# EAGLE design DK_ESC (EAGLE 7.7.0)
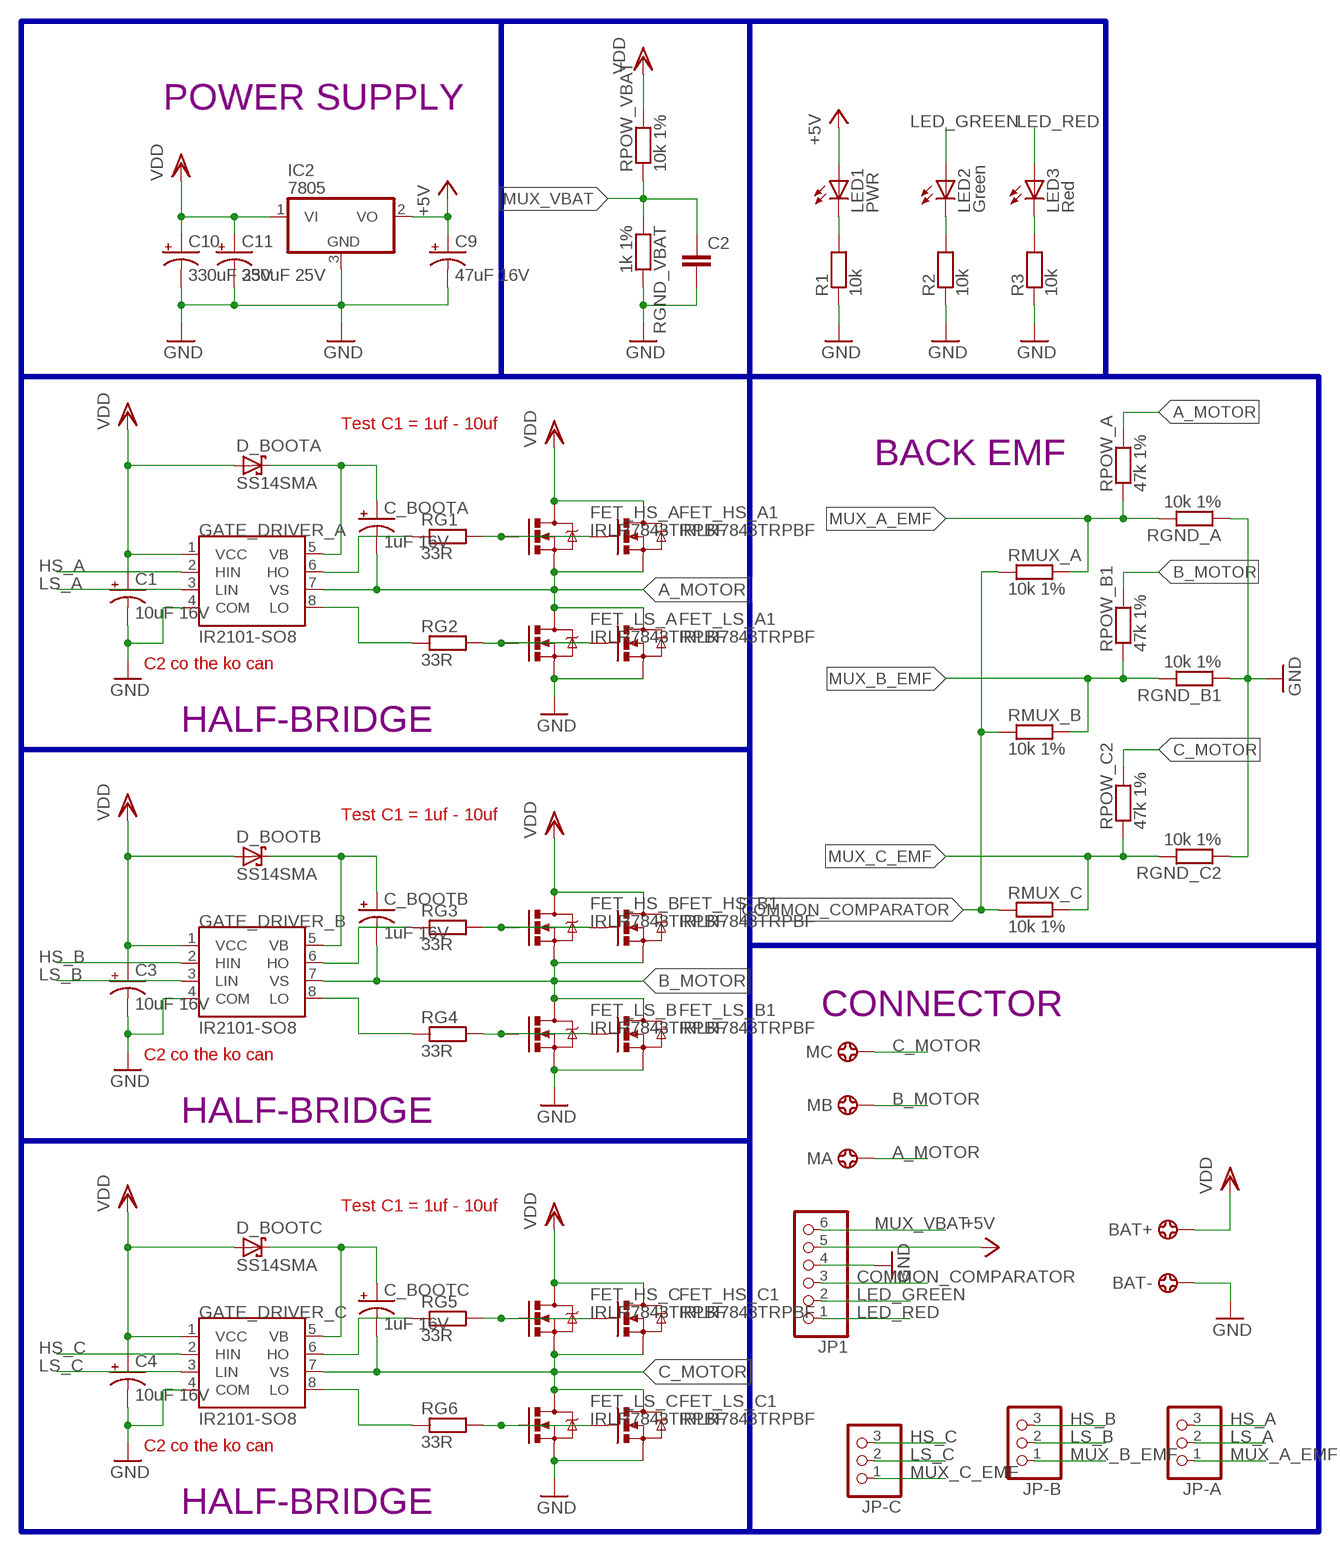
[diagram p0: schematic, sheet 1]

## Parts
BAT+  14AWG_PAD-PAD  [14AWG]
BAT-  14AWG_PAD-PAD  [14AWG]
C1  10uF 16V  CAP_POL1206-KIT  [EIA3216-KIT]
C2  C-SMDC0805K  [C0805K]
C3  10uF 16V  CAP_POL1206-KIT  [EIA3216-KIT]
C4  10uF 16V  CAP_POL1206-KIT  [EIA3216-KIT]
C9  47uF 16V  C-TANT-SMDEIA6032  [CT6032]
C10  330uF 25V  CAP_POLPTH  [CPOL-PTH-330UF-16V]
C11  330uF 25V  CAP_POLPTH  [CPOL-PTH-330UF-16V]
C_BOOTA  1uF 16V  CAP_POL1206-KIT  [EIA3216-KIT]
C_BOOTB  1uF 16V  CAP_POL1206-KIT  [EIA3216-KIT]
C_BOOTC  1uF 16V  CAP_POL1206-KIT  [EIA3216-KIT]
D_BOOTA  SS14SMA  [DO214AC]
D_BOOTB  SS14SMA  [DO214AC]
D_BOOTC  SS14SMA  [DO214AC]
FET_HS_A  IRLR7843TRPBF  IRLR7843TRPBF-DPAK  [TO252]
FET_HS_A1  IRLR7843TRPBF  IRLR7843TRPBF-DPAK  [TO252]
FET_HS_B  IRLR7843TRPBF  IRLR7843TRPBF-DPAK  [TO252]
FET_HS_B1  IRLR7843TRPBF  IRLR7843TRPBF-DPAK  [TO252]
FET_HS_C  IRLR7843TRPBF  IRLR7843TRPBF-DPAK  [TO252]
FET_HS_C1  IRLR7843TRPBF  IRLR7843TRPBF-DPAK  [TO252]
FET_LS_A  IRLR7843TRPBF  IRLR7843TRPBF-DPAK  [TO252]
FET_LS_A1  IRLR7843TRPBF  IRLR7843TRPBF-DPAK  [TO252]
FET_LS_B  IRLR7843TRPBF  IRLR7843TRPBF-DPAK  [TO252]
FET_LS_B1  IRLR7843TRPBF  IRLR7843TRPBF-DPAK  [TO252]
FET_LS_C  IRLR7843TRPBF  IRLR7843TRPBF-DPAK  [TO252]
FET_LS_C1  IRLR7843TRPBF  IRLR7843TRPBF-DPAK  [TO252]
GATE_DRIVER_A  IR2101-SO8  [SO08]
GATE_DRIVER_B  IR2101-SO8  [SO08]
GATE_DRIVER_C  IR2101-SO8  [SO08]
IC2  7805  78XXX-3P05-TO252  [TO252]
JP1  PINHD-1X6  [1X06]
JP-A  PINHD-1X3  [1X03]
JP-B  PINHD-1X3  [1X03]
JP-C  PINHD-1X3  [1X03]
LED1  PWR  LED0805  [LED_0805]
LED2  Green  LED0805  [LED_0805]
LED3  Red  LED0805  [LED_0805]
MA  14AWG_PAD-PAD  [14AWG]
MB  14AWG_PAD-PAD  [14AWG]
MC  14AWG_PAD-PAD  [14AWG]
R1  10k  RESISTOR-SMDR0805  [R0805]
R2  10k  RESISTOR-SMDR0805  [R0805]
R3  10k  RESISTOR-SMDR0805  [R0805]
RG1  33R  RESISTOR-SMDR0603  [R0603]
RG2  33R  RESISTOR-SMDR0603  [R0603]
RG3  33R  RESISTOR-SMDR0603  [R0603]
RG4  33R  RESISTOR-SMDR0603  [R0603]
RG5  33R  RESISTOR-SMDR0603  [R0603]
RG6  33R  RESISTOR-SMDR0603  [R0603]
RGND_A  10k 1%  RESISTOR-SMDR0805  [R0805]
RGND_B1  10k 1%  RESISTOR-SMDR0805  [R0805]
RGND_C2  10k 1%  RESISTOR-SMDR0805  [R0805]
RGND_VBAT  1k 1%  RESISTOR-SMDR0805  [R0805]
RMUX_A  10k 1%  RESISTOR-SMDR0805  [R0805]
RMUX_B  10k 1%  RESISTOR-SMDR0805  [R0805]
RMUX_C  10k 1%  RESISTOR-SMDR0805  [R0805]
RPOW_A  47k 1%  RESISTOR-SMDR0603  [R0603]
RPOW_B1  47k 1%  RESISTOR-SMDR0603  [R0603]
RPOW_C2  47k 1%  RESISTOR-SMDR0603  [R0603]
RPOW_VBAT  10k 1%  RESISTOR-SMDR0805  [R0805]

## Nets
+5V: C9.+ IC2.2(VO) JP1.5 LED1.A
A_MOTOR: C_BOOTA.C(-) FET_HS_A1.3(S) FET_HS_A.3(S) FET_LS_A1.2(D) FET_LS_A.2(D) GATE_DRIVER_A.7(VS) MA.1 RPOW_A.2
B_MOTOR: C_BOOTB.C(-) FET_HS_B1.3(S) FET_HS_B.3(S) FET_LS_B1.2(D) FET_LS_B.2(D) GATE_DRIVER_B.7(VS) MB.1 RPOW_B1.2
C_MOTOR: C_BOOTC.C(-) FET_HS_C1.3(S) FET_HS_C.3(S) FET_LS_C1.2(D) FET_LS_C.2(D) GATE_DRIVER_C.7(VS) MC.1 RPOW_C2.2
COMMON_COMPARATOR: JP1.3 RMUX_A.1 RMUX_B.1 RMUX_C.1
GND: BAT-.1 C1.C(-) C2.2 C3.C(-) C4.C(-) C9.- C10.- C11.- FET_LS_A1.3(S) FET_LS_A.3(S) FET_LS_B1.3(S) FET_LS_B.3(S) FET_LS_C1.3(S) FET_LS_C.3(S) GATE_DRIVER_A.4(COM) GATE_DRIVER_B.4(COM) GATE_DRIVER_C.4(COM) IC2.3(GND) JP1.4 R1.1 R2.1 R3.1 RGND_A.1 RGND_B1.1 RGND_C2.1 RGND_VBAT.2
HS_A: GATE_DRIVER_A.2(HIN) JP-A.3
HS_B: GATE_DRIVER_B.2(HIN) JP-B.3
HS_C: GATE_DRIVER_C.2(HIN) JP-C.3
LED_GREEN: JP1.2 LED2.A
LED_RED: JP1.1 LED3.A
LS_A: GATE_DRIVER_A.3(LIN) JP-A.2
LS_B: GATE_DRIVER_B.3(LIN) JP-B.2
LS_C: GATE_DRIVER_C.3(LIN) JP-C.2
MUX_A_EMF: JP-A.1 RGND_A.2 RMUX_A.2 RPOW_A.1
MUX_B_EMF: JP-B.1 RGND_B1.2 RMUX_B.2 RPOW_B1.1
MUX_C_EMF: JP-C.1 RGND_C2.2 RMUX_C.2 RPOW_C2.1
MUX_VBAT: C2.1 JP1.6 RGND_VBAT.1 RPOW_VBAT.1
N$1: FET_LS_A1.1(G) FET_LS_A.1(G) RG2.2
N$2: FET_HS_A1.1(G) FET_HS_A.1(G) RG1.2
N$3: FET_LS_B1.1(G) FET_LS_B.1(G) RG4.2
N$4: GATE_DRIVER_A.6(HO) RG1.1
N$5: GATE_DRIVER_A.8(LO) RG2.1
N$6: FET_HS_B1.1(G) FET_HS_B.1(G) RG3.2
N$7: GATE_DRIVER_B.6(HO) RG3.1
N$8: GATE_DRIVER_B.8(LO) RG4.1
N$9: FET_LS_C1.1(G) FET_LS_C.1(G) RG6.2
N$10: FET_HS_C1.1(G) FET_HS_C.1(G) RG5.2
N$11: GATE_DRIVER_C.6(HO) RG5.1
N$12: GATE_DRIVER_C.8(LO) RG6.1
N$13: LED1.C R1.2
N$16: LED2.C R2.2
N$17: LED3.C R3.2
VB: C_BOOTA.A(+) C_BOOTB.A(+) C_BOOTC.A(+) D_BOOTA.C D_BOOTB.C D_BOOTC.C GATE_DRIVER_A.5(VB) GATE_DRIVER_B.5(VB) GATE_DRIVER_C.5(VB)
VDD: BAT+.1 C1.A(+) C3.A(+) C4.A(+) C10.+ C11.+ D_BOOTA.A D_BOOTB.A D_BOOTC.A FET_HS_A1.2(D) FET_HS_A.2(D) FET_HS_B1.2(D) FET_HS_B.2(D) FET_HS_C1.2(D) FET_HS_C.2(D) GATE_DRIVER_A.1(VCC) GATE_DRIVER_B.1(VCC) GATE_DRIVER_C.1(VCC) IC2.1(VI) RPOW_VBAT.2

## Buses
B$1

## Notes on the sheet
- POWER SUPPLY
- Test C1 = 1uf - 10uf
- BACK EMF
- C2 co the ko can
- HALF-BRIDGE
- Test C1 = 1uf - 10uf
- CONNECTOR
- C2 co the ko can
- HALF-BRIDGE
- Test C1 = 1uf - 10uf
- C2 co the ko can
- HALF-BRIDGE

## Library data of the parts
BAT+ BAT- MA MB MC = Connector:14AWG_PAD: This pad use for Lipo wire
C1 C3 C4 C_BOOTA C_BOOTB C_BOOTC = Cap-Pol-Smd:CAP_POL: Capacitor Polarized These are standard SMD and PTH capacitors. Normally 10uF, 47uF, and 100uF in electrolytic and tantalum varieties. Always verify the external diameter of the through hole cap, it varies with capacity, voltage, and manufacturer. The EIA devices should be standard.
C2 = RCL:C-SMD: Capacitor Standard 0603 ceramic capacitor, and 0.1" leaded capacitor. Có đuôi "K" là loại Reflow solder
C9 = RCL:C-TANT-SMD: Tụ tantalum SMD Tụ tantalum SMD 3216 - 7343. The EIA devices should be standard.
C10 C11 = DangKiet:CAP_POL: Capacitor Polarized These are standard SMD and PTH capacitors. Normally 10uF, 47uF, and 100uF in electrolytic and tantalum varieties. Always verify the external diameter of the through hole cap, it varies with capacity, voltage, and manufacturer. The EIA devices should be standard.
D_BOOTA D_BOOTB D_BOOTC = Diode:SS14: Schottky Diode
FET_HS_A FET_HS_A1 FET_HS_B FET_HS_B1 FET_HS_C FET_HS_C1 FET_LS_A FET_LS_A1 FET_LS_B FET_LS_B1 FET_LS_C FET_LS_C1 = FET:IRLR7843TRPBF: N-Channel161A-30V, rDS(on)=0.0033 Ohm @ Vgs 10V, 140W
GATE_DRIVER_A GATE_DRIVER_B GATE_DRIVER_C = GateDriver:IR2101: High and Low Side Driver. Gate drive supply range from 10 to 20V. 3.3V, 5V logic input compatible
IC2 = Regulator-linear:78XXX-3P: Positive VOLTAGE REGULATOR Added bigger pads to the TO-92 package
JP1 = pinhead:PINHD-1X6: PIN HEADER
JP-A JP-B JP-C = pinhead:PINHD-1X3: PIN HEADER
LED1-LED3 = LED:LED: LEDs Standard schematic elements and footprints for 5mm, 3mm, 1206, and 0603 sized LEDs. 5mm - Spark Fun Electronics SKU : COM-00529 (and others)
R1-R3 RG1-RG6 RGND_A RGND_B1 RGND_C2 RGND_VBAT RMUX_A RMUX_B RMUX_C RPOW_A RPOW_B1 RPOW_C2 RPOW_VBAT = RCL:RESISTOR-SMD: Resistor Basic schematic elements and footprints for 0603, 0805, 1206, 2010, 2512 resistors.

## Board
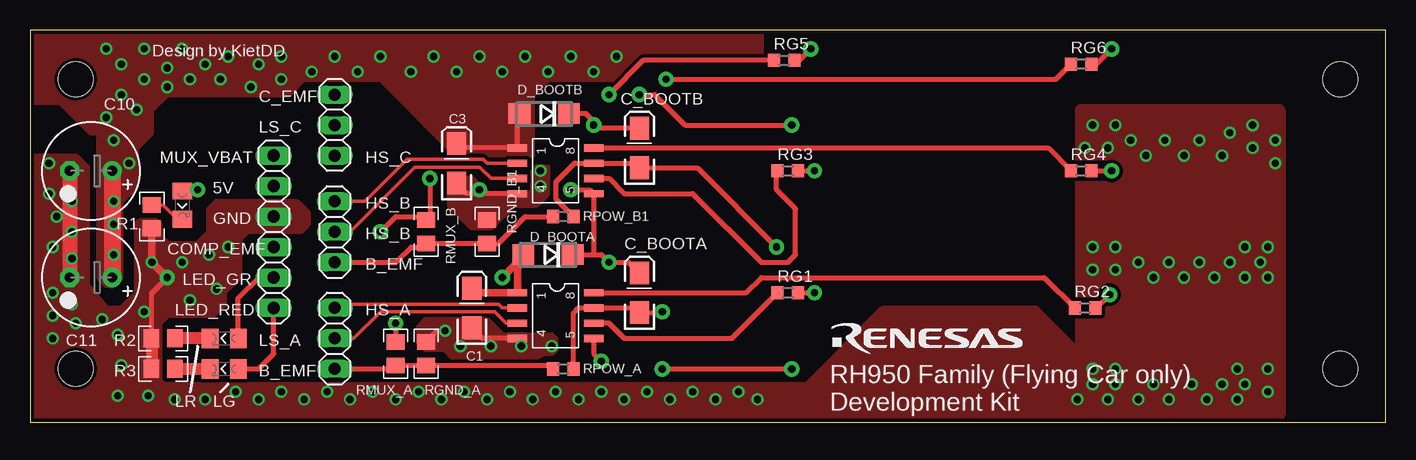
[diagram p1: board, top side]
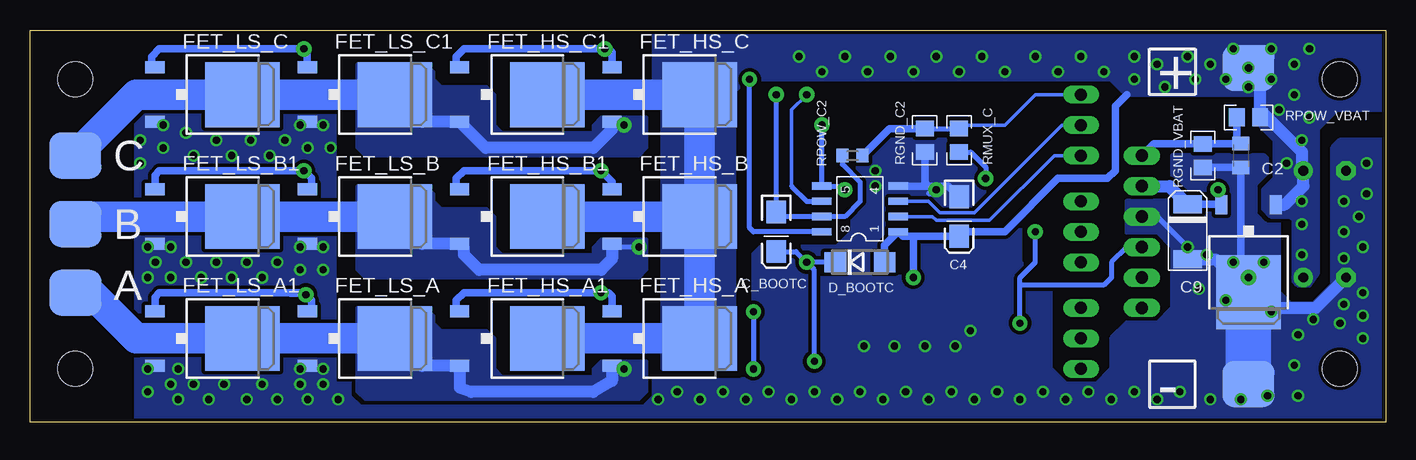
[diagram p2: board, bottom side, seen from below]

Size 113.01 x 32.69 mm. Coordinates in mm from the lower left corner, seen from the top.
Outline: 0,0 113.01,0 113.01,32.69 0,32.69 0,0
Copper layers (1*16): Top 0.035mm / dielectric 1.5mm / Bottom 0.035mm
Design rules "default *": minimum track width 10mil, minimum drill 24mil, track to track 8mil, track to pad 8mil, pad to pad 8mil, via to via 8mil, smd to smd 8mil, copper to edge 12mil, drill to drill 8mil, minimum pad ring 10mil, minimum via ring 8mil, stop-mask expansion 4mil, vias tented up to drill 25mil, thermal gap 10mil
Holes 2.9 mm at 109.22,28.57 109.22,4.45 3.81,4.45 3.81,28.57

### Footprints (pad centres in the part's own frame; a part is rotated, then mirrored left to right if it is on the bottom)
14AWG = smd 4.318 x 3.81: 1 0,0
EIA3216-KIT = smd 1.9 x 1.6: A 1.65,0; C -1.65,0
C0805K = smd 1.1 x 1.4: 1 -1,0; 2 1,0
CT6032 = smd 1.5 x 2.4: + -2.3,0; - 2.3,0
CPOL-PTH-330UF-16V = drill 0.813 pad 1.6: + -1.778,0 | drill 0.813 pad 1.6 octagon: - 1.778,0
DO214AC = smd 1.8 x 1.7: A 2.05,0; C -2.05,0
TO252 = smd 1 x 1.6: 1 -2.28,-4.8; 3 2.28,-4.8 | smd 5.4 x 6.2: 2 0,2.5
SO08 = smd 0.61 x 1.626: 1 -2.54,-2.54; 2 -1.27,-2.54; 3 0,-2.54; 4 1.27,-2.54; 5 1.27,3.81; 6 0,3.81; 7 -1.27,3.81; 8 -2.54,3.81
TO252' = smd 1 x 1.6: 1 -2.28,-4.8; 2 2.28,-4.8 | smd 5.4 x 6.2: 3 0,2.5
1X06 = drill 1.016 long: 1 -6.35,0; 2 -3.81,0; 3 -1.27,0; 4 1.27,0; 5 3.81,0; 6 6.35,0
1X03 = drill 1 long: 1 -2.54,0; 2 0,0; 3 2.54,0
LED_0805 = smd 1.6 x 1.4: A 0,-1.177; C 0,1.177
R0805 = smd 1.3 x 1.5: 1 -0.977,0; 2 0.977,0
R0603 = smd 1 x 1.1: 1 -0.85,0; 2 0.85,0

### Placement (x,y rotation side)
BAT+  11.43,29.53 0 bottom
BAT-  11.43,3.17 0 bottom
C1  36.83,9.53 90 top
C2  12.06,22.23 270 bottom
C3  35.56,21.59 90 top
C4  35.56,17.14 270 bottom
C9  16.51,15.88 270 bottom
C10  5.08,20.95 180 top
C11  5.08,12.06 180 top
C_BOOTA  50.8,10.79 90 top
C_BOOTB  50.8,22.86 90 top
C_BOOTC  50.8,15.88 270 bottom
D_BOOTA  43.18,13.97 180 top
D_BOOTB  42.86,25.72 180 top
D_BOOTC  43.81,13.34 0 bottom
FET_HS_A  59.69,6.99 270 bottom
FET_HS_A1  72.39,6.99 270 bottom
FET_HS_B  59.69,17.14 270 bottom
FET_HS_B1  72.39,17.14 270 bottom
FET_HS_C  59.69,27.3 270 bottom
FET_HS_C1  72.39,27.3 270 bottom
FET_LS_A  85.09,6.99 270 bottom
FET_LS_A1  97.79,6.99 270 bottom
FET_LS_B  85.09,17.14 270 bottom
FET_LS_B1  97.79,17.14 270 bottom
FET_LS_C  97.79,27.3 270 bottom
FET_LS_C1  85.09,27.3 270 bottom
GATE_DRIVER_A  43.18,8.26 270 top
GATE_DRIVER_B  43.18,20.32 270 top
GATE_DRIVER_C  43.18,18.41 90 bottom
IC2  7805  [TO252']  11.43,13.34 180 bottom
JP1  20.32,15.88 90 top
JP-A  25.4,6.99 90 top
JP-B  25.4,15.88 90 top
JP-C  25.4,24.77 270 top
LED1  12.7,18.1 180 top
LED2  16.19,6.99 90 top
LED3  16.19,4.45 90 top
MA  109.22,10.79 180 bottom
MB  109.22,16.51 180 bottom
MC  109.22,22.23 180 bottom
R1  10.16,17.14 90 top
R2  11.11,6.99 0 top
R3  11.11,4.45 0 top
RG1  63.18,10.79 0 top
RG2  87.95,9.53 0 top
RG3  63.18,20.95 0 top
RG4  87.63,20.95 0 top
RG5  62.87,30.16 0 top
RG6  87.63,29.84 0 top
RGND_A  33.02,5.71 270 top
RGND_B1  38.1,15.88 270 top
RGND_C2  38.42,23.5 90 bottom
RGND_VBAT  15.24,22.23 270 bottom
RMUX_A  30.48,5.71 270 top
RMUX_B  33.02,15.88 270 top
RMUX_C  35.56,23.5 90 bottom
RPOW_A  44.45,4.45 0 top
RPOW_B1  44.45,17.14 0 top
RPOW_C2  44.45,22.23 180 bottom
RPOW_VBAT  11.43,25.4 0 bottom
U$2  RENESAS  [RENESAS]  66.67,4.76 0 top

### Tracks (layer width: path | path; a pad name or v marks a point on that pad's centre or on a via)
+5V  (via drill 0.6 pad 1.27)
  Top 0.305: LED1.A 13.88,19.27 v13.97,19.37
  Bottom 0.305: v13.97,19.37 13.97,18.49 14.29,18.18
  Bottom 0.61: C9.+ 14.29,18.18 13.75,18.18 IC2.2
  Bottom 1.016: JP1.5 18.02,19.68 C9.+
A_MOTOR  (via drill 0.6 pad 1.27)
  Top 0.406: RPOW_A.2 45.3,9.11 45.72,9.53 GATE_DRIVER_A.7 50.42,9.53 C_BOOTA.C 52.64,9.14 v52.7,9.21 | v52.7,4.45 v63.5,4.45
  Bottom 0.406: v52.7,9.21 v52.7,4.45 | v63.5,4.45 64.23,4.45 FET_HS_A.3
  Bottom 1.016: FET_HS_A.3 64.49,3.46 66.04,2.54 76.2,2.54 77.19,2.9 FET_HS_A1.3 80.31,4.71 FET_LS_A.2
  Bottom 2.54: FET_LS_A.2 FET_LS_A1.2 104.14,6.99 107.95,10.79 MA.1
  pour Bottom (isolate 0.305, no thermals): 61.59,5.08 65.41,5.08 66.04,4.45 66.04,3.81 73.66,3.81 74.3,4.45 74.3,6.99 74.93,7.62 78.74,7.62 79.38,8.26 79.38,8.89 80.01,9.53 85.72,9.53 85.72,2.54 85.09,1.91 62.23,1.91 61.59,2.54
B_MOTOR  (via drill 0.6 pad 1.27)
  Top 0.406: v62.23,14.61 55.62,21.21 C_BOOTB.C 50.42,21.59 GATE_DRIVER_B.7 45.4,21.59 43.81,20 43.81,18.63 RPOW_B1.2
  Bottom 0.406: v62.23,14.61 64.23,14.61 FET_HS_B.3
  Bottom 1.016: FET_LS_B.2 80.31,14.87 FET_HS_B1.3 76.83,14.51 76.83,13.97 75.56,12.7 65.41,12.7 64.49,13.62 FET_HS_B.3
  Bottom 2.54: FET_LS_B.2 FET_LS_B1.2 108.58,17.14 MB.1
  pour Bottom (isolate 0.305, no thermals): 61.59,15.24 65.41,15.24 66.04,14.61 66.04,13.97 73.66,13.97 74.3,14.61 74.3,17.14 74.93,17.78 78.74,17.78 79.38,18.41 79.38,19.05 80.01,19.68 85.72,19.68 85.72,12.7 85.09,12.06 62.23,12.06 61.59,12.7
C_MOTOR  (via drill 0.6 pad 1.27)
  Top 0.406: v50.8,27.3 52.07,27.3 54.61,24.77 v63.5,24.77
  Bottom 0.406: v50.8,27.3 C_BOOTC.C 50.8,17.14 GATE_DRIVER_C.7 45.09,17.14 43.81,18.41 43.81,20 45.3,21.49 RPOW_C2.2 | v63.5,24.77 64.23,24.77 FET_HS_C.3
  Bottom 0.61: 50.42,17.14 C_BOOTC.C
  Bottom 1.016: FET_LS_C1.2 80.31,25.02 FET_HS_C1.3 75.03,22.86 66.04,22.86 64.49,24.41 FET_HS_C.3
  Bottom 2.54: FET_LS_C1.2 FET_LS_C.2 104.14,27.3 MC.1
  pour Bottom (isolate 0.305, no thermals): 61.59,25.4 65.41,25.4 66.04,24.77 66.04,24.13 73.66,24.13 74.3,24.77 74.3,27.3 74.93,27.94 78.74,27.94 79.38,28.57 79.38,29.21 80.01,29.84 85.72,29.84 85.72,22.86 85.09,22.23 62.23,22.23 61.59,22.86
COMMON_COMPARATOR  (via drill 0.6 pad 1.27)
  Top 0.406: v33.34,20.32 33.34,17.17 RMUX_B.1 32.73,17.14 30.48,17.14 v29.21,15.88 | v30.48,8.26 RMUX_A.1
  Bottom 0.406: RMUX_C.1 34.58,22.52 33.34,21.27 v33.34,20.32 | v30.48,8.26 30.48,11.43 | 30.48,11.43 30.48,12.06 29.21,13.34 v29.21,15.88 | JP1.3 21.59,14.61 22.86,13.34 22.86,12.06 23.5,11.43 30.48,11.43
GND  (via drill 0.6, 0.6 pad 1.27)
  Top 0.406: GATE_DRIVER_A.4 37.72,6.99 C1.C | R3.1 10.14,10.77 v11.43,12.06 | GATE_DRIVER_B.4 36.45,19.05 C3.C | v34.61,7.62 33.95,7.62 RGND_A.1
  Top 0.61: 35.81,19.68 C3.C | R1.1 v10.16,13.34 v11.43,12.06
  Top 1.016: R2.1 R3.1
  Top 1.27: C10.- C11.-
  Bottom 0.406: JP1.4 19.05,17.14 v16.51,14.61 C9.- | 37.15,19.68 37.47,19.68 38.1,19.05 37.47,19.05 36.83,19.68 37.15,19.68 | 37.15,19.68 v37.47,19.37
  Bottom 0.61: GATE_DRIVER_C.4 38.1,19.68 | 38.1,19.68 36.83,19.68 36.45,19.68 C4.C | RGND_C2.1 38.42,20 38.1,19.68 | IC2.3 v11.43,12.06 12.06,12.7 C2.2 12.09,21.25 RGND_VBAT.2
  Bottom 1.016: C9.- 14.17,13.57 IC2.3 11.43,10.79 10.16,9.53 5.84,9.53 C11.-
  Bottom 3.81: BAT-.1 IC2.3
  other vias: 35.88,6.35 38.42,6.35 40.96,6.35 43.5,6.35 42.55,20.95 42.55,19.68 1.59,21.59 1.59,19.05 3.49,18.41 2.22,17.14 3.49,15.88 1.91,14.61 3.49,13.65 1.91,10.79 1.91,8.89 3.49,9.84 6.03,8.57 3.81,8.26 1.91,6.99 7.3,7.3 7.62,4.76 7.3,2.22 9.84,2.22 9.53,9.21 12.7,13.34 14.92,13.97 15.56,11.11 13.34,10.16 12.06,1.91 14.61,1.91 17.14,2.54 19.05,1.91 20.95,2.54 22.86,1.91 24.77,2.54 26.67,1.91 28.57,2.54 30.48,1.91 32.38,2.54 34.29,1.91 36.2,2.54 38.1,1.91 40.01,2.54 41.91,1.91 43.81,2.54 45.72,1.91 47.62,2.54 49.53,1.91 51.44,2.54 53.34,1.91 55.24,2.54 57.15,1.91 59.05,2.54 60.64,1.91 87.31,1.91 88.58,3.17 88.58,4.45 90.49,4.45 90.49,3.17 89.85,1.91 92.39,1.91 93.66,3.17 94.93,1.91 96.84,3.17 98.11,1.91 99.38,3.17 100.65,1.91 101.28,3.17 100.65,4.45 103.19,4.45 103.19,2.54 88.58,12.7 90.49,12.7 88.58,14.61 90.49,14.61 92.39,13.34 93.66,12.06 94.93,13.34 96.2,12.06 97.47,13.34 98.74,12.06 100.01,13.34 101.28,12.06 102.55,13.34 101.28,14.61 103.19,14.61 103.19,12.06 88.58,24.77 87.95,22.86 90.49,24.77 93.03,22.23 94.61,23.5 96.2,22.23 97.47,23.5 99.38,22.23 100.01,24.13 101.92,24.77 103.82,23.5 103.82,21.59 101.92,22.86 91.76,23.5 89.85,22.86
  pour Top (isolate 0.305, rank 6): 87.63,26.04 104.14,26.04 104.14,0.64 87.63,0.64
  pour Bottom (isolate 0.305, rank 6, no thermals): -1.27,23.5 3.81,23.5 4.45,22.86 4.45,11.43 6.03,9.84 7.94,9.84 8.89,10.79 8.89,20.95 10.16,22.23 17.78,22.23 17.78,18.41 21.59,18.41 21.59,15.88 19.05,15.88 17.78,14.61 17.78,9.53 19.05,8.26 21.59,8.26 22.86,6.99 22.86,4.45 24.13,3.17 26.67,3.17 27.94,4.45 27.94,10.79 30.48,13.34 30.48,22.23 31.75,23.5 41.91,23.5 44.45,20.95 44.45,15.88 45.72,14.61 52.07,14.61 52.7,13.97 52.7,4.45 53.66,3.49 87.63,3.17 87.63,27.3 104.14,27.3 104.14,-4.45 -1.27,-4.45
  pour Top (isolate 0.305, no thermals): 34.92,20.32 34.92,18.1 36.83,16.19 38.42,16.19 40.32,18.1 42.23,18.1 43.18,19.05 43.18,21.27 42.23,21.27 41.91,20.95 41.91,19.37 41.59,19.05 38.1,19.05 36.83,20.32
  pour Top (isolate 0.305, no thermals): 32.38,7.94 33.02,8.57 38.1,8.57 39.37,7.3 43.5,7.3 43.81,6.99 43.81,6.03 43.5,5.71 42.86,5.71 42.23,5.4 35.24,5.4 34.61,6.03 33.02,6.03 32.38,6.67
  pour Top (isolate 0.305, no thermals): -1.27,22.23 3.81,22.23 4.76,21.27 4.76,11.43 6.35,9.53 7.62,9.53 8.89,10.79 8.89,16.51 9.21,16.83 10.48,16.83 10.79,16.51 10.79,15.56 11.43,14.92 13.97,14.92 14.92,15.88 14.92,17.78 15.56,18.41 22.23,18.41 23.18,17.46 23.18,16.51 22.54,15.88 18.1,15.88 17.46,15.24 17.46,12.06 16.19,10.79 16.19,9.84 15.24,8.89 11.43,8.89 10.79,8.26 10.79,3.49 11.11,3.17 64.77,3.17 71.12,9.53 83.82,9.53 87.63,5.71 104.14,5.71 104.14,-3.17 -1.27,-3.17
HS_A
  Top 0.305: GATE_DRIVER_A.2 39.37,9.53 39.05,9.84 25.72,9.84 JP-A.3
HS_B
  Top 0.305: GATE_DRIVER_B.2 38.1,21.59 37.78,21.91 31.43,21.91 27.94,18.41 JP-B.3
HS_C
  Bottom 0.305: GATE_DRIVER_C.2 37.78,17.14 37.47,16.83 33.02,16.83 27.62,22.23 JP-C.3
LED_GREEN
  Top 0.406: LED2.A 17.37,10.38 19.05,12.06 JP1.2
LED_RED
  Top 0.406: LED3.A 19.05,4.45 20.32,5.71 JP1.1
LS_A
  Top 0.305: GATE_DRIVER_A.3 39.69,8.26 38.73,9.21 29.21,9.21 26.99,6.99 JP-A.2
LS_B
  Top 0.305: GATE_DRIVER_B.3 38.42,20.32 37.47,21.27 32.07,21.27 26.67,15.88 JP-B.2
LS_C
  Bottom 0.305: GATE_DRIVER_C.3 38.1,18.41 37.15,17.46 34.29,17.46 26.99,24.77 JP-C.2
MUX_A_EMF
  Top 0.406: 43.31,4.15 RPOW_A.1 43.31,4.74 RGND_A.2 RMUX_A.2 30.19,4.45 JP-A.1
MUX_B_EMF
  Top 0.305: 26.67,13.34 JP-B.1
  Top 0.406: RPOW_B1.1 41.27,17.14 39.03,14.9 RGND_B1.2 RMUX_B.2 32.73,14.61 31.75,14.61 30.48,13.34 26.67,13.34
MUX_C_EMF
  Bottom 0.305: JP-C.1 29.21,27.3 31.75,24.77 35.27,24.77 RMUX_C.2
  Bottom 0.406: RGND_C2.2 RMUX_C.2 | 43.31,22.52 RPOW_C2.1
  Bottom 0.61: RGND_C2.2 41.35,24.47 RPOW_C2.1
MUX_VBAT
  Bottom 0.61: 12.7,23.2 RGND_VBAT.1 19.34,23.2 JP1.6 | 12.7,23.2 12.09,23.2 C2.1 | RPOW_VBAT.1 12.41,23.5 12.7,23.2
N$1  (via drill 0.6 pad 1.27)
  Top 0.406: RG2.2 88.9,9.53 v90.01,10.64
  Bottom 0.406: v90.01,10.64 91.28,10.64 91.44,10.79
  Bottom 0.61: FET_LS_A1.1 102.59,10.44 102.23,10.79 91.44,10.79 90.17,10.79 v90.01,10.64 89.53,10.16 89.53,9.62 FET_LS_A.1
N$2  (via drill 0.6 pad 1.27)
  Top 0.406: RG1.2 v65.41,10.79
  Bottom 0.61: FET_HS_A.1 64.49,10.52 64.77,10.79 v65.41,10.79 76.83,10.79 77.47,10.16 77.47,9.54 FET_HS_A1.1
N$3  (via drill 0.6 pad 1.27)
  Top 0.406: RG4.2 v90.17,20.95
  Bottom 0.61: FET_LS_B1.1 102.59,20.6 102.23,20.95 v90.17,20.95 89.53,20.32 89.53,19.78 FET_LS_B.1
N$4
  Top 0.406: GATE_DRIVER_A.6 48.26,8.26 49.53,6.99 58.52,6.99 RG1.1
N$5
  Top 0.406: GATE_DRIVER_A.8 59.69,10.79 60.96,12.06 84.56,12.06 RG2.1
N$6  (via drill 0.6 pad 1.27)
  Top 0.406: RG3.2 v65.41,20.95
  Bottom 0.61: FET_HS_B.1 64.49,20.04 v65.41,20.95 76.83,20.95 77.47,20.32 77.47,19.7 FET_HS_B1.1
N$7
  Top 0.406: GATE_DRIVER_B.6 48.26,20.32 49.53,19.05 55.24,19.05 60.96,13.34 63.18,13.34 63.82,13.97 63.82,17.78 62.23,19.37 62.23,20.85 RG3.1
N$8
  Top 0.406: GATE_DRIVER_B.8 84.88,22.86 RG4.1
N$9  (via drill 0.6 pad 1.27)
  Top 0.406: RG6.2 88.9,29.84 v90.17,31.11
  Bottom 0.61: FET_LS_C1.1 89.89,30.84 v90.17,31.11 102.23,31.11 102.87,30.48 102.87,29.86 FET_LS_C.1
N$10  (via drill 0.6 pad 1.27)
  Top 0.406: RG5.2 64.14,30.16 v65.09,31.11
  Bottom 0.61: FET_HS_C.1 64.49,30.84 64.77,31.11 v65.09,31.11 76.83,31.11 77.47,30.48 77.47,29.86 FET_HS_C1.1
N$11  (via drill 0.6 pad 1.27)
  Top 0.406: RG5.1 51.12,30.16 v48.26,27.3
  Bottom 0.305: v48.26,27.3 49.53,26.04 49.53,19.68
  Bottom 0.406: 49.53,19.68 48.26,18.41 GATE_DRIVER_C.6
N$12  (via drill 0.6 pad 1.27)
  Top 0.406: v53.02,28.57 85.51,28.57 RG6.1
  Bottom 0.406: GATE_DRIVER_C.8 52.7,15.88 53.02,16.19 v53.02,28.57
N$13
  Top 0.305: LED1.C 12.29,16.92 11.11,18.1 10.18,18.1 R1.2
N$16
  Top 1.016: LED2.C R2.2
N$17
  Top 1.016: R3.2 LED3.C
VB  (via drill 0.6 pad 1.27)
  Top 0.406: GATE_DRIVER_A.5 46.99,5.71 v47.62,5.08 | C_BOOTA.A 49.91,13.34 v48.26,13.34 47.62,13.97 46.99,13.97 | D_BOOTA.C 46.99,13.97 | D_BOOTB.C 46.35,25.72 46.99,25.08 v46.99,24.77 47.24,24.51 C_BOOTB.A | 46.99,13.97 GATE_DRIVER_B.5 46.67,19.37 v45.09,19.37
  Bottom 0.406: v47.62,5.08 47.62,12.7 v48.26,13.34 | D_BOOTC.C v48.26,13.34 | C_BOOTC.A 49.15,14.22 v48.26,13.34 | v46.99,24.77 GATE_DRIVER_C.5 45.4,19.68 v45.09,19.37
VDD  (via drill 0.6 pad 0.41, 0.6 pad 1.27)
  Top 0.406: D_BOOTB.A 40.64,25.55 GATE_DRIVER_B.1 35.94,22.86 C3.A
  Top 0.61: C1.A 37.21,10.79 GATE_DRIVER_A.1 40.64,13.48 D_BOOTA.A 41.13,13.82 v39.37,12.06
  Top 1.422: C10.+ C11.+
  Bottom 0.406: 35.56,15.88 C4.A
  Bottom 0.61: C4.A 39.37,15.49 | 39.37,15.49 40.26,15.49 GATE_DRIVER_C.1 41.77,14.75 D_BOOTC.A | 71.12,17.14 FET_HS_B1.2 68.58,17.14 | v39.37,12.06 39.37,15.49 | 35.56,15.88 31.75,15.88 27.3,20.32 23.18,20.32 22.54,20.95 22.54,26.35 21.59,27.3
  Bottom 1.016: BAT+.1 10.45,28.87 RPOW_VBAT.2 10.45,26.01 6.99,22.54 6.99,21.08 C10.+ 6.86,19.68 8.41,18.14 IC2.1
  Bottom 2.54: 69.85,27.3 FET_HS_C.2 FET_HS_B.2 | 69.89,27.27 69.85,27.3 | 69.85,27.3 FET_HS_C1.2 | FET_HS_B.2 68.58,17.14 69.85,17.14 | FET_HS_B.2 FET_HS_A.2 FET_HS_A1.2
  other vias: 46.99,29.21 48.9,30.48 45.09,30.48 43.18,29.21 41.27,30.48 39.37,29.21 37.47,30.48 35.56,29.21 33.66,30.48 31.75,29.21 29.21,30.48 27.3,29.21 25.4,30.48 23.5,29.21 20.95,30.48 20.95,28.57 18.41,27.94 19.05,29.84 16.51,30.48 15.88,28.57 14.61,29.84 12.7,31.11 13.34,28.57 11.43,27.94 11.43,29.53 9.53,31.11 9.53,28.57 7.62,29.84 6.35,31.11 7.62,27.3 6.35,25.4 8.89,26.04 6.99,23.5 8.26,21.59 6.99,18.41 6.99,16.51 6.99,13.97
  pour Bottom (isolate 0.305, no thermals): 54.29,29.84 60.33,29.84 60.33,4.45 54.29,4.45
  pour Bottom (isolate 0.305, no thermals): 8.89,34.92 8.89,27.3 21.59,27.3 22.86,28.57 53.34,28.57 54.61,27.3 60.96,27.3 60.96,34.92
  pour Top (isolate 0.305, no thermals): -1.27,33.66 -1.27,27.3 -0.64,26.67 2.54,26.67 5.08,24.13 5.71,24.13 5.71,12.06 6.35,11.43 6.99,11.43 7.62,12.06 7.62,18.41 8.89,19.68 8.89,22.86 10.16,24.13 10.16,26.04 11.43,27.3 21.59,27.3 22.86,28.57 29.21,28.57 35.56,22.23 41.91,22.23 41.91,27.3 43.18,28.57 53.34,28.57 54.61,27.3 60.96,27.3 60.96,33.66
  pour Bottom (isolate 0.305, no thermals): 5.71,24.45 5.71,12.38 6.35,11.43 7.3,11.43 7.62,11.75 7.62,16.83 7.94,17.14 9.53,17.14 10.16,17.78 10.16,19.37 9.21,20.32 9.21,23.5 10.79,25.08 10.79,34.29 11.43,34.92 -1.27,34.92 -1.27,26.04 4.13,26.04

### Text on the board
tNames: Design by KietDD | C_EMF | D_BOOTB | LS_C | MUX_VBAT | HS_C | 5V | HS_B | GND | HS_B | COMP_EMF | B_EMF | LED_GR | LED_RED | HS_A | R2 | LS_A | R3 | B_EMF | LR | LG | RH950 Family (Flying Car only) / Development Kit
bNames: + | C | B | A | -